# EAGLE design SAMD11 Arduino Small Form Factor (EAGLE 9.4.2)
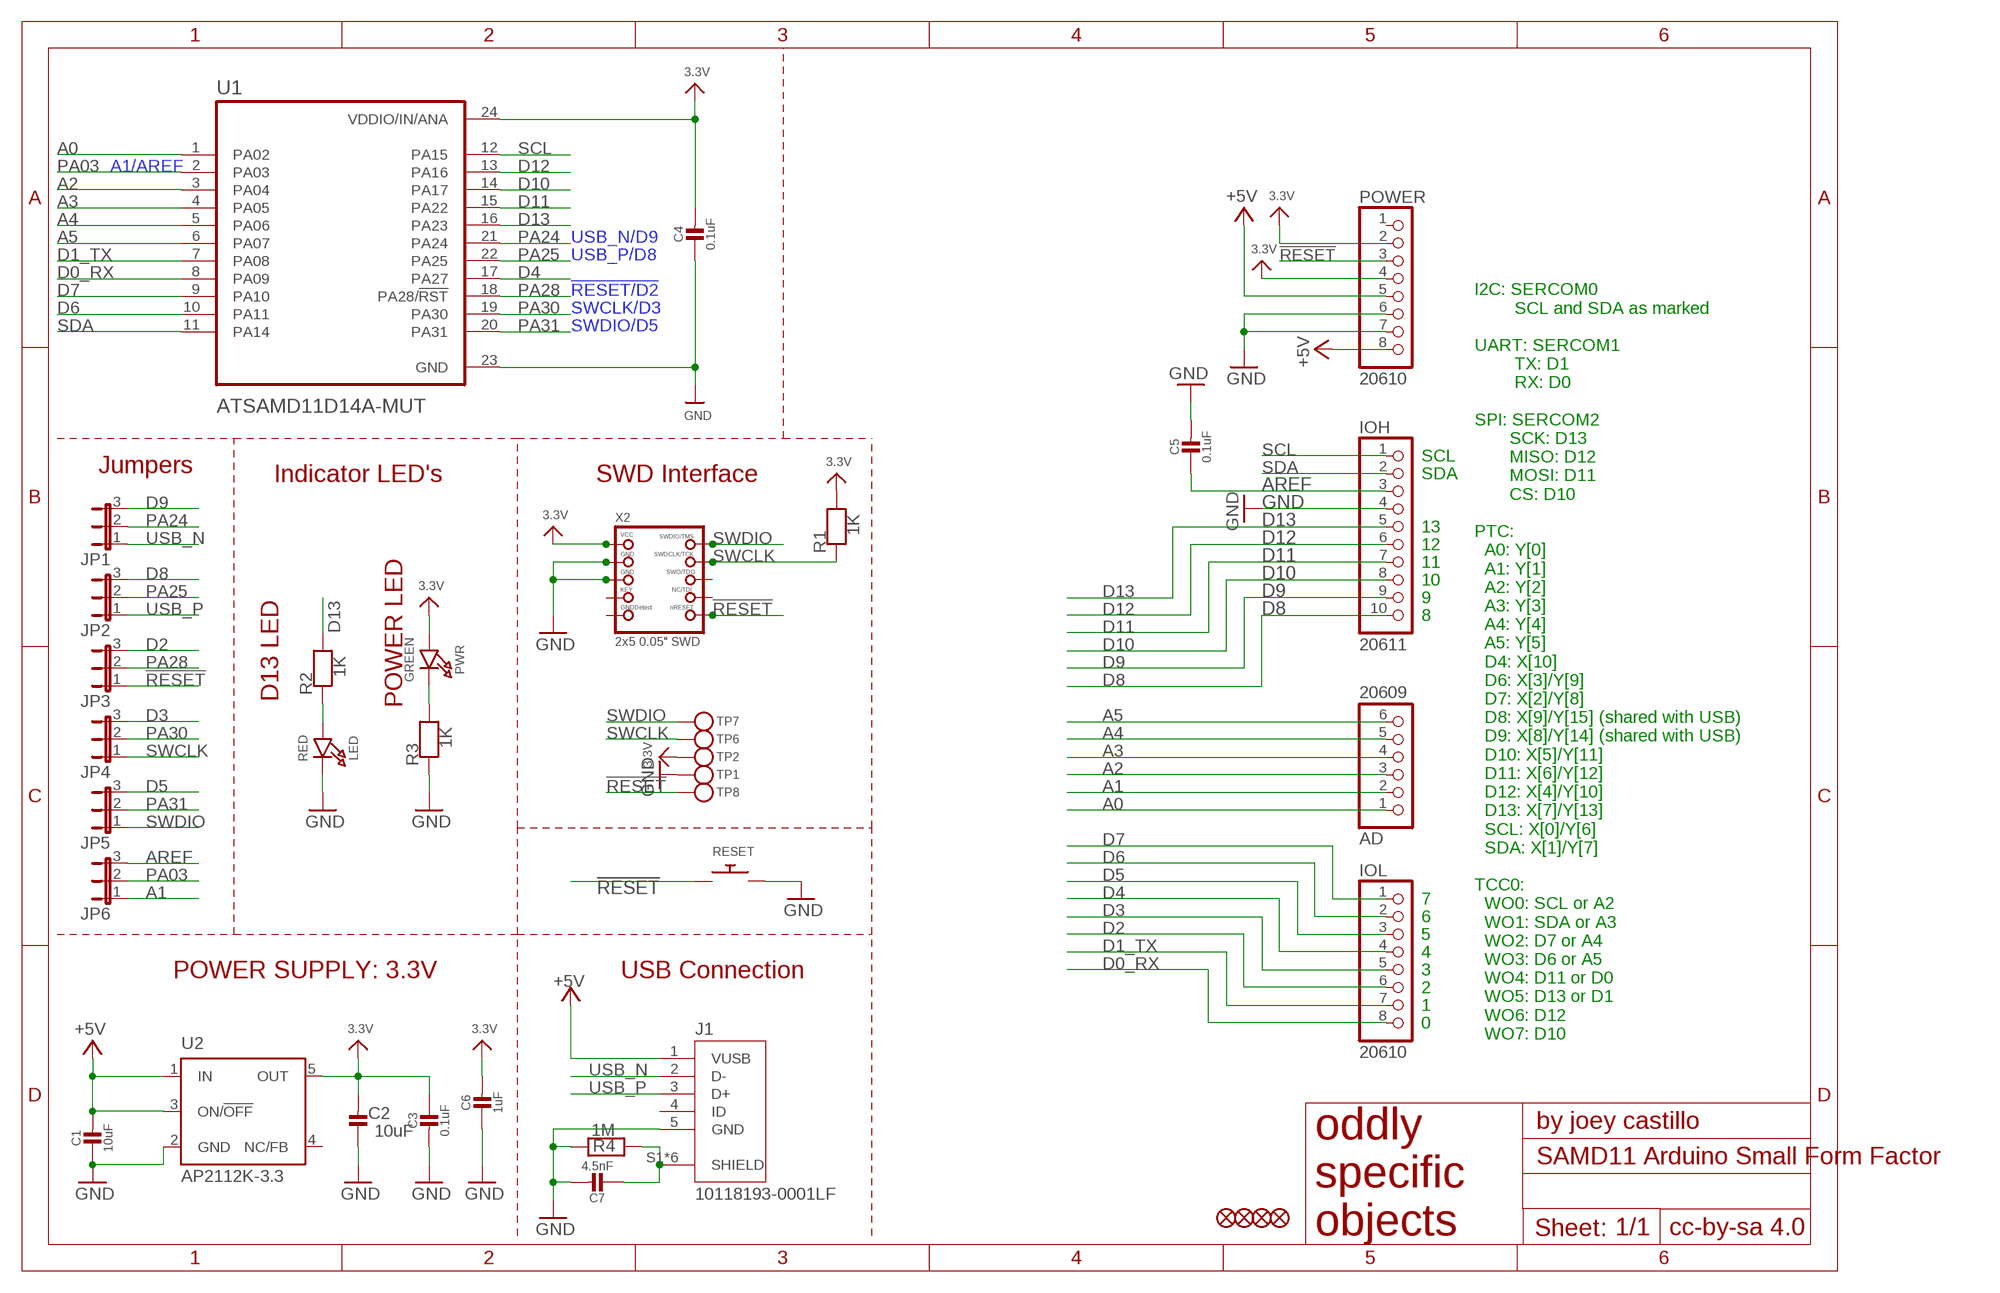
[diagram p0: schematic, sheet 1, part 1 of 2]
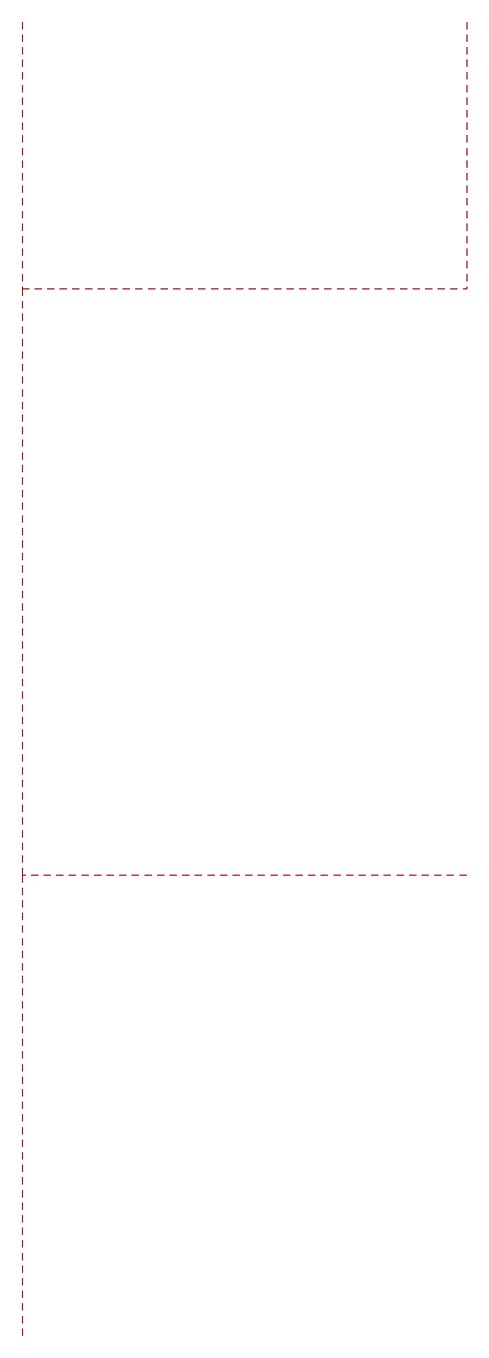
[diagram p1: schematic, sheet 1, part 2 of 2]

## Parts
AD  20609  HEADER-1X6OVALWAVE  [1X06_OVALWAVE]
C1  10uF  CAP_CERAMIC0805-NOOUTLINE  [0805-NO]
C2  10uF  CAP_CERAMIC0805-NOOUTLINE  [0805-NO]
C3  0.1uF  CAP_CERAMIC0805-NOOUTLINE  [0805-NO]
C4  0.1uF  CAP_CERAMIC0805-NOOUTLINE  [0805-NO]
C5  0.1uF  CAP_CERAMIC0805-NOOUTLINE  [0805-NO]
C6  1uF  CAP_CERAMIC0805-NOOUTLINE  [0805-NO]
C7  4.5nF  CAP_CERAMIC0805-NOOUTLINE  [0805-NO]
FD1  FIDUCIAL_1MM  [FIDUCIAL_1MM]
FD2  FIDUCIAL_1MM  [FIDUCIAL_1MM]
FD3  FIDUCIAL_1MM  [FIDUCIAL_1MM]
FD4  FIDUCIAL_1MM  [FIDUCIAL_1MM]
IOH  20611  HEADER-1X10OVALWAVE  [1X10_OVALWAVE]
IOL  20610  HEADER-1X8OVALWAVE  [1X08_OVALWAVE]
J1  10118193-0001LF  [FCI_10118193-0001LF]
JP1  JP2E  [JP2]
JP2  JP2E  [JP2]
JP3  JP2E  [JP2]
JP4  JP2E  [JP2]
JP5  JP2E  [JP2]
JP6  JP2E  [JP2]
LED  RED  LED0805_NOOUTLINE  [CHIPLED_0805_NOOUTLINE]
POWER  20610  HEADER-1X8OVALWAVE  [1X08_OVALWAVE]
PWR  GREEN  LED0805_NOOUTLINE  [CHIPLED_0805_NOOUTLINE]
R1  1K  RESISTOR0805_NOOUTLINE  [0805-NO]
R2  1K  RESISTOR0805_NOOUTLINE  [0805-NO]
R3  1K  RESISTOR0805_NOOUTLINE  [0805-NO]
R4  1M  RESISTOR0805_NOOUTLINE  [0805-NO]
RESET  SWITCH_PUSHBUTTONEVQ-PE  [TACT_PANA-EVQ]
TP1  TESTPOINTROUND2MMNO  [TESTPOINT_ROUND_2MM_NO]
TP2  TESTPOINTROUND2MMNO  [TESTPOINT_ROUND_2MM_NO]
TP6  TESTPOINTROUND2MMNO  [TESTPOINT_ROUND_2MM_NO]
TP7  TESTPOINTROUND2MMNO  [TESTPOINT_ROUND_2MM_NO]
TP8  TESTPOINTROUND2MMNO  [TESTPOINT_ROUND_2MM_NO]
U1  ATSAMD11D14A-MUT  [QFN50P400X400X90-25N]
U2  AP2112K-3.3  LP2985-XXDBVR33  [SOT23-DBV]
X2  2x5 0.05" SWD  JTAG-CORTEXBOXPOSTS  [2X05_1.27MM_BOX_POSTS]

## Nets
3.3V [power]: C2.2 C3.1 C4.2 C6.2 POWER.2 POWER.4 PWR.A R1.2 TP2.P$1 U1.24(VDDIO/IN/ANA) U2.5(OUT) X2.1(VCC)
!RESET: JP3.1 POWER.3 RESET.P$1 TP8.P$1 X2.10(NRESET)
+5V [power]: C1.2 J1.1(VUSB) POWER.5 POWER.8 U2.1(IN) U2.3(ON/!OFF)
A0: AD.1 U1.1(PA02)
A1: AD.2 JP6.1
A2: AD.3 U1.3(PA04)
A3: AD.4 U1.4(PA05)
A4: AD.5 U1.5(PA06)
A5: AD.6 U1.6(PA07)
AREF [aref]: C5.1 IOH.3 JP6.3
D0_RX: IOL.8 U1.8(PA09)
D1_TX: IOL.7 U1.7(PA08)
D2: IOL.6 JP3.3
D3: IOL.5 JP4.3
D4: IOL.4 U1.17(PA27)
D5: IOL.3 JP5.3
D6: IOL.2 U1.10(PA11)
D7: IOL.1 U1.9(PA10)
D8: IOH.10 JP2.3
D9: IOH.9 JP1.3
D10: IOH.8 U1.14(PA17)
D11: IOH.7 U1.15(PA22)
D12: IOH.6 U1.13(PA16)
D13: IOH.5 R2.2 U1.16(PA23)
GND [gnd]: C1.1 C2.1 C3.2 C4.1 C5.2 C6.1 C7.2 IOH.4 J1.5(GND) LED.C POWER.6 POWER.7 R3.1 R4.2 RESET.P$2 TP1.P$1 U1.23(GND) U2.2(GND) X2.3(GND) X2.5(GND)
N$1: LED.A R2.1
N$3: PWR.C R3.2
PA03: JP6.2 U1.2(PA03)
PA24 [USB]: JP1.2 U1.21(PA24)
PA25 [USB]: JP2.2 U1.22(PA25)
PA28: JP3.2 U1.18(PA28/!RST)
PA30: JP4.2 U1.19(PA30)
PA31: JP5.2 U1.20(PA31)
SCL: IOH.1 U1.12(PA15)
SDA: IOH.2 U1.11(PA14)
SHIELD [gnd]: C7.1 J1.S1(SHIELD) J1.S2(SHIELD) J1.S3(SHIELD) J1.S4(SHIELD) J1.S5(SHIELD) J1.S6(SHIELD) R4.1
SWCLK: JP4.1 R1.1 TP6.P$1 X2.4(SWDCLK)
SWDIO: JP5.1 TP7.P$1 X2.2(SWDIO)
USB_N [USB]: J1.2(D-) JP1.1
USB_P [USB]: J1.3(D+) JP2.1
Unconnected: J1.4(ID) POWER.1 U2.4(NC/FB) X2.6(SWO) X2.7(KEY) X2.8(TDI) X2.9(GNDDETECT)

## Notes on the sheet
- A1/AREF
- USB_N/D9
- USB_P/D8
- !RESET/D2
- SWCLK/D3
- SWDIO/D5
- SCL
- Jumpers
- Indicator LED's | SWD Interface | SDA
- 13
- 12
- 11
- 10
- 9
- 8
- POWER LED
- D13 LED
- 7
- 6
- 5
- 4
- POWER SUPPLY: 3.3V | USB Connection | 3
- 2
- 1
- 0
- I2C: SERCOM0
          SCL and SDA as marked
  
  UART: SERCOM1
          TX: D1
          RX: D0
  
  SPI: SERCOM2
         SCK: D13
         MISO: D12
         MOSI: D11
         CS: D10
  
  PTC:
    A0: Y[0]
    A1: Y[1]
    A2: Y[2]
    A3: Y[3]
    A4: Y[4]
    A5: Y[5]
    D4: X[10]
    D6: X[3]/Y[9]
    D7: X[2]/Y[8]
    D8: X[9]/Y[15] (shared with USB)
    D9: X[8]/Y[14] (shared with USB)
    D10: X[5]/Y[11]
    D11: X[6]/Y[12]
    D12: X[4]/Y[10]
    D13: X[7]/Y[13]
    SCL: X[0]/Y[6]
    SDA: X[1]/Y[7]
  
  TCC0:
    WO0: SCL or A2
    WO1: SDA or A3
    WO2: D7 or A4
    WO3: D6 or A5
    WO4: D11 or D0
    WO5: D13 or D1
    WO6: D12
    WO7: D10

## Library data of the parts
AD = microbuilder:HEADER-1X6: PIN HEADER
C1-C7 = microbuilder:CAP_CERAMIC: Ceramic Capacitors For new designs, use the packages preceded by an '_' character since they are more reliable: The following footprints should be used on most boards: _0402 - Standard footprint for regular board layouts _0603 - Standard footprint for regular board layouts _0805 - Standard footprint for regular board layouts _1206 - Standard footprint for regular board layouts For extremely tight-pitch boards where space is at a premium, the following 'micro-pitch' footprints can be used (smaller pads, no silkscreen outline, etc.): _0402MP - Micro-pitch footprint for very dense/compact boards _0603MP - Micro-pitch footprint for very dense/compact boards _0805MP - Micro-pitch footprint for very dense/compact boards _1206MP - Micro-pitch footprint for very dense/compact boards
FD1-FD4 = microbuilder:FIDUCIAL: Fiducial Alignment Points Various fiducial points for machine vision alignment.; BOM: EXCLUDE
IOH = microbuilder:HEADER-1X10: PIN HEADER
IOL POWER = microbuilder:HEADER-1X8: PIN HEADER
J1 = 10118193-0001LF:10118193-0001LF: Micro USB B Type Receptacle; DESCRIPTION: Single Port 5 Contact Shielded SMT MICRO USB B-Type Receptacle; DIGI-KEY_PART_NUMBER: 609-4616-1-ND; DIGI-KEY_PURCHASE_URL: https://www.digikey.com/product-detail/en/amphenol-icc-fci/10118193-0001LF/609-4616-1-ND/2785380?utm_source=snapeda&utm_medium=aggregator&utm_campaign=symbol; MF: Amphenol ICC; MP: 10118193-0001LF; PACKAGE: None
JP1-JP6 = jumper:JP2E: JUMPER
LED PWR = microbuilder:LED: LED 0603 - 0603 Surface Mount Package 2mA: Green LED - Low Power (3.9mcd, 2ma, 1.7Vf) - Digikey: 475-2709-2-ND Orange LED - Low Power (9.8mcd, 2ma, 1.8Vf) - Digikey: 475-1194-2-ND Red LED - Low Power (5mcd, 2ma, 1.8Vf) - Digikey: 475-1195-2-ND Yellow LED - Low Power (7mcd, 2ma, 1.8Vf) - Digikey: 475-1196-2-ND 5mA: Blue LED - Low Power (17mcd, 5ma, 2.9Vf) - Digikey: LNJ937W8CRACT-ND 0805 - 0805 Surface Mount Package 2mA: Red LED (8.8mcd, 2mA, 1.8Vf, Clear) - Low Power [Digikey: 475-2510-1-ND] Green LED (5mcd, 2mA, 1.8Vf, Clear) - Low Power [Digikey: 475-2730-1-ND] Yellow LED (11.3mcd, 2mA, 1.8Vf, Clear) - Low Power [Digikey: 475-2555-1-ND] 20mA: Red LED (104mcd, 20mA, Diffused) - LS R976 [Digikey: 475-1278-6-ND] Red LED (12mcd, 20mA, 2.0Vf, Clear) - APT2012EC [Digikey: 754-1128-1-ND] Green LED (15mcd, 20mA, 2.2Vf, Clear) - APT2012GC [Digikey: 754-1131-1-ND] Orange LED (160mcd, 20mA, 2.1Vf, Clear) - APT2012SECK [Digikey: 754-1130-1-ND] 1206 - 1206 Surface Mount Package Green LED (26mcd, 20mA, Diffused) - LG N971 [Digikey: 475-1407-6-ND] Red LED (15mcd, 20mA, Diffused) - LH N974 [Digikey: 475-1416-6-ND] Cree - Cree High-Power Surface Mount LEDs XPEBWT-L1-0000-00D50 - White 111lm 350mA 2.9Vf 6200K 110° XTEAWT-00-0000-00000LEE3 - White 114lm 350mA 2.85Vf 5000K 115° Everlight - Everlight 45-21 Series Surface Mount LEDs 45-21/QK2C-B2832AC2CB2/2T - Warm White 2000mcd 20mA 3.25Vf 3050K 120° 45-21/LK2C-B38452C4CB2/2T - Nuetral White 2000mcd 20mA 3.25Vf 4150K 120° 45-21/LK2C-B50634C6CB2/2T - Cold White 2200mcd 20mA 3.25Vf 5650K 120° PLCC2 Reverse Mount LS T77K-J1L2-1-0-2-R18-Z - Red 11.25mcd 2mA 1.8Vf 630nm 120° LO T77K-L1M2-24-Z - Orange 19.6mcd 2mA 1.8Vf 606nm 120° LY T77K-K2M1-26-Z - Yellow 15.7mcd 2mA 1.8Vf 587nm 120°
R1-R4 = microbuilder:RESISTOR: Resistors For new designs, use the packages preceded by an '_' character since they are more reliable: The following footprints should be used on most boards: _0402 - Standard footprint for regular board layouts _0603 - Standard footprint for regular board layouts _0805 - Standard footprint for regular board layouts _1206 - Standard footprint for regular board layouts For extremely tight-pitch boards where space is at a premium, the following 'micro-pitch' footprints can be used (smaller pads, no silkscreen outline, etc.): _0402MP - Micro-pitch footprint for very dense/compact boards _0603MP - Micro-pitch footprint for very dense/compact boards _0805MP - Micro-pitch footprint for very dense/compact boards _1206MP - Micro-pitch footprint for very dense/compact boards
RESET = adafruit:SWITCH_PUSHBUTTON: Buttons SOFTTOUCHSMD_SJ - Soft touch temporary push button (Super Junk Akihabara) Compatible with SKPMANE010 [Mouser: 688-SKPMAN] C&K_KSS = Digikey: KSS221GLFS
TP1 TP2 TP6-TP8 = microbuilder:TESTPOINT: Test Point Various test points for characterisation and PCB testing TESTPOINT_SMT - Compact Surface Mount Test Point [Digikey: 5016KTR-ND]
U1 = ATSAMD11D14A-MUT:ATSAMD11D14A-MUT: None; AVAILABILITY: Unavailable; DESCRIPTION: Cortex-M0+, 16KB FLASH, 4KB SRAM, USB - 24 QFN, INDUSTRIAL, GREEN, 1.6-3.6V, 48MHz/ QFN _ZA_; MF: Microchip; MP: ATSAMD11D14A-MUT; PACKAGE: QFN-24 Microchip; PRICE: None
U2 = SmartPrj:LP2985-XXDBVR: ULTRALOW-POWER 50-mA LOW-DROPOUT LINEAR REGULATORS 50-mA Low-Dropout Regulator Source: http://focus.ti.com/lit/ds/symlink/tps77001.pdf
X2 = microbuilder:JTAG-CORTEX: Serial Wire (SW-DP) Connector Standard 0.05" 10-pin connector is for use with the Cortex M and Cortex A SWD (serial wire debugger) interface (SW-DP) Connectors 2x05_1.27MM_SMT - Inexpensive surface-mount header with bare pins, compatible with standard 10-pin SWD cables (4UCON: 16846) 2x05_1.27MM_BOX_NOPOSTS - Polarised surface-mount box (4UCON with caps: 19735, without caps: 15117 2x05_1.27MM_BOX_POSTS - Polarised surface-mount box with mounting holes (4UCON: 20317) Pinout: http://infocenter.arm.com/help/topic/com.arm.doc.faqs/attached/13634/cortex_debug_connectors.pdf http://www.keil.com/peripherals/coresight/connectors.asp

## Net classes
0 default: width 0.152 mm, drill 0.254 mm
1 USB: width 0.152 mm, drill 0.254 mm
2 gnd: width 0.254 mm, drill 0.254 mm
3 power: width 0.305 mm, drill 0.305 mm
4 aref: width 0.152 mm, drill 0.254 mm

## Board
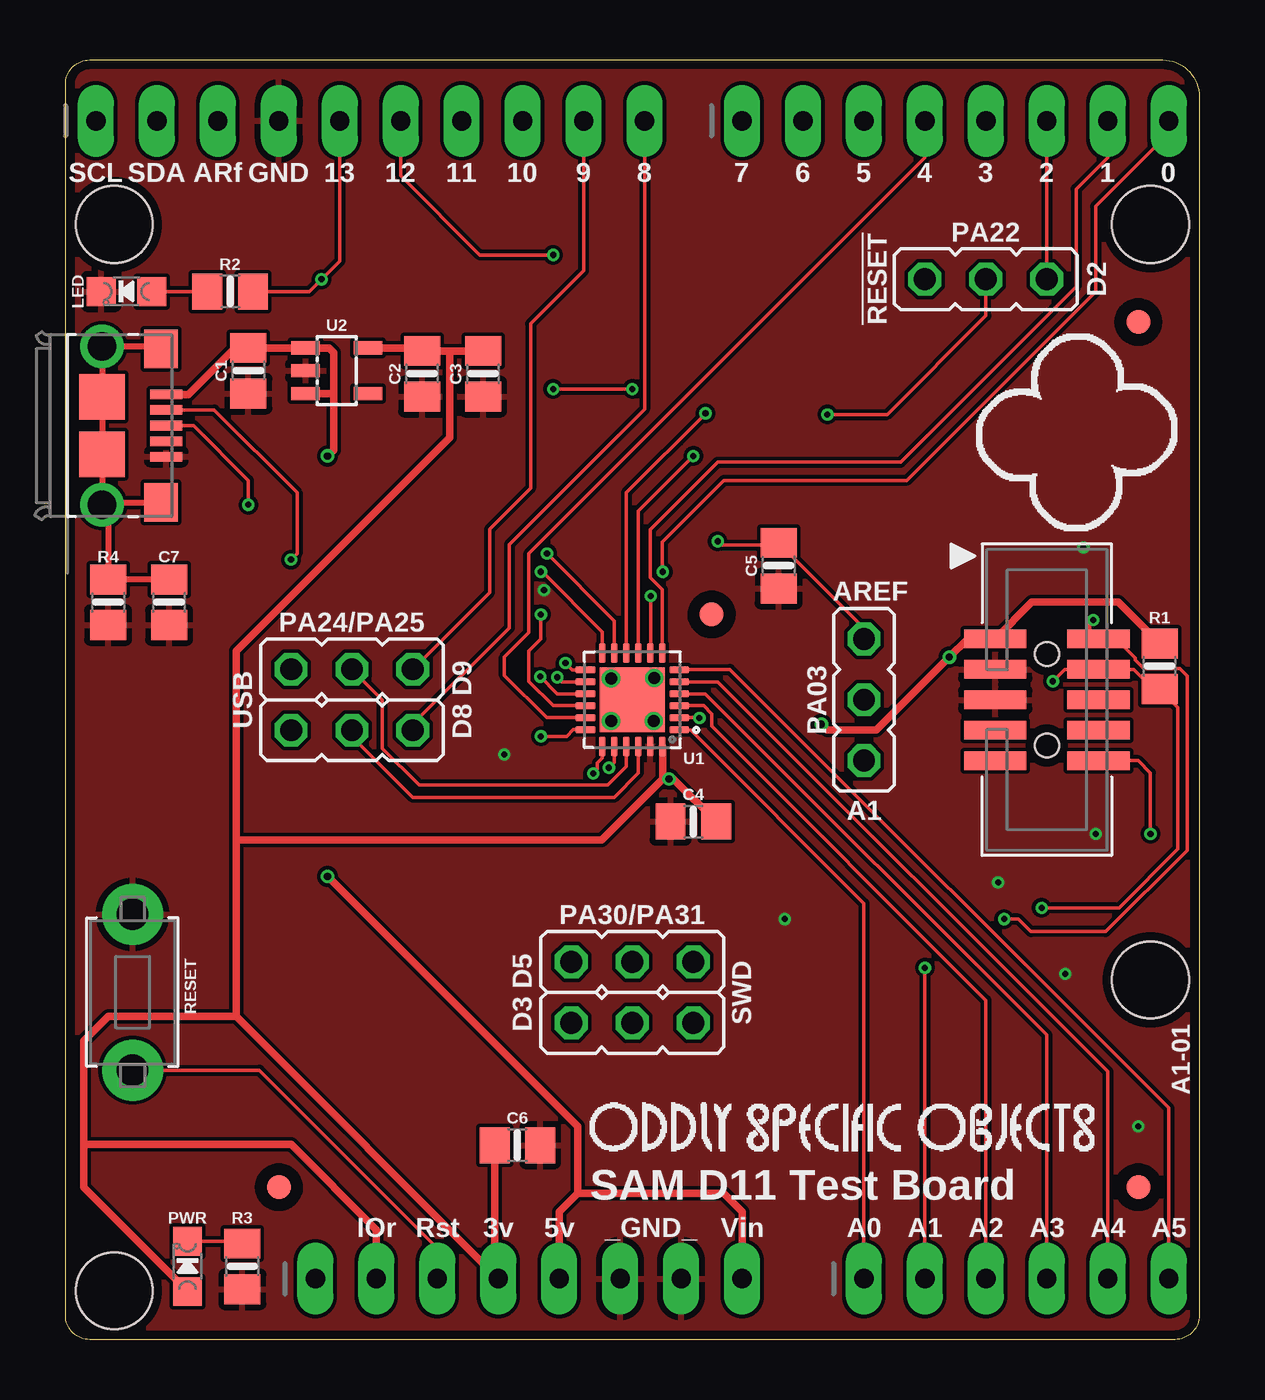
[diagram p2: board, top side]
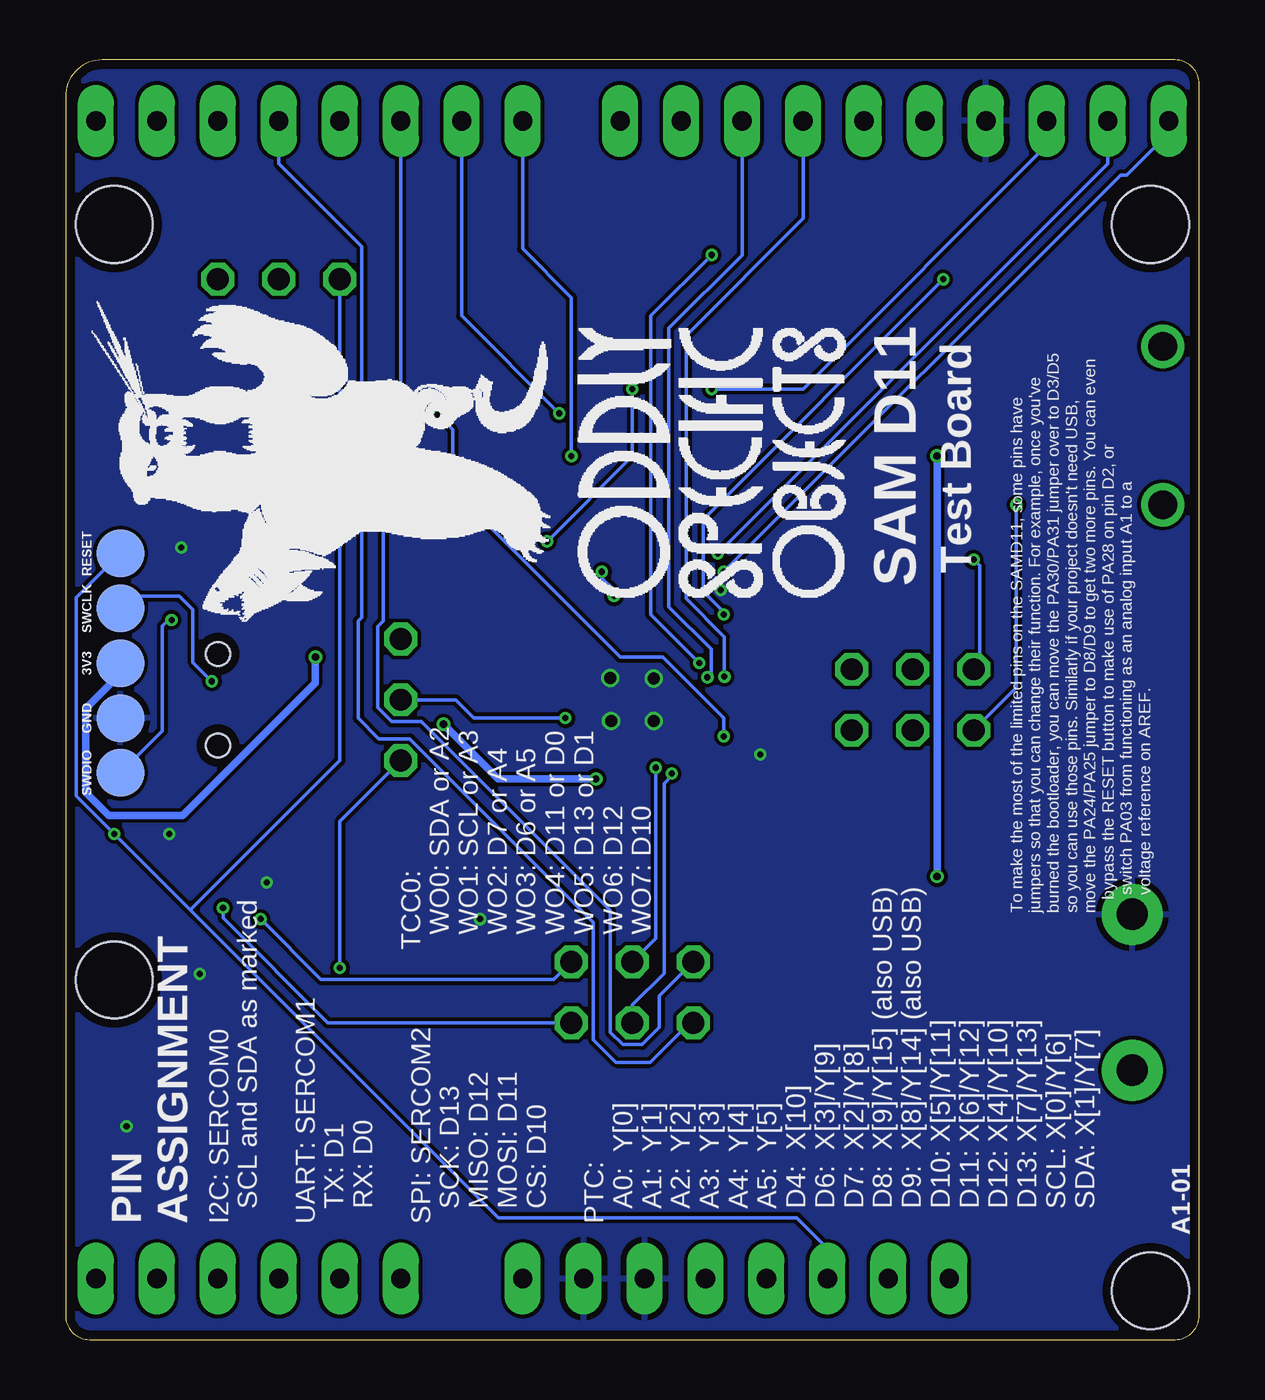
[diagram p3: board, bottom side, seen from below]

Size 47.24 x 53.34 mm. Coordinates in mm from the lower left corner, seen from the top.
Outline: 45.72,53.34 arc-90 47.24,51.82 47.24,1 arc-90 46.24,0 1,0 arc-90 0,1 0,52.34 arc-90 1,53.34 45.72,53.34
Copper layers (1*16): Top 0.035559375mm / dielectric 1.6mm / Bottom 0.035559375mm
Design rules "oshpark-2layer *": minimum track width 6mil, minimum drill 10mil, track to track 6mil, track to pad 6mil, pad to pad 6mil, via to via 6mil, smd to smd 6mil, copper to edge 15mil, drill to drill 6mil, minimum pad ring 5mil, minimum via ring 5mil, stop-mask expansion 2.5mil, vias tented up to drill 12mil, thermal gap 10mil
Holes 3.2 mm at 45.21,46.48 45.21,14.99 2.03,46.48 2.03,2.03

### Footprints (pad centres in the part's own frame; a part is rotated, then mirrored left to right if it is on the bottom)
1X06_OVALWAVE = drill 0.8 pad 1.5 long: 1 -6.35,0; 2 -3.81,0; 3 -1.27,0; 4 1.27,0; 5 3.81,0; 6 6.35,0
0805-NO = smd 1.24 x 1.5: 1 -0.95,0; 2 0.95,0
FIDUCIAL_1MM = smd 1 x 1: 1 0,0
1X10_OVALWAVE = drill 0.8 pad 1.5 long: 1 -11.43,0; 2 -8.89,0; 3 -6.35,0; 4 -3.81,0; 5 -1.27,0; 6 1.27,0; 7 3.81,0; 8 6.35,0; 9 8.89,0; 10 11.43,0
1X08_OVALWAVE = drill 0.8 pad 1.5 long: 1 -8.89,0; 2 -6.35,0; 3 -3.81,0; 4 -1.27,0; 5 1.27,0; 6 3.81,0; 7 6.35,0; 8 8.89,0
FCI_10118193-0001LF = smd 0.4 x 1.35: 1 -1.3,2.675; 2 -0.65,2.675; 3 0,2.675; 4 0.65,2.675; 5 1.3,2.675 | smd 1.6 x 1.4: S1 -3.2,2.45; S2 3.2,2.45 | smd 1.9 x 1.9: S3 1.2,0; S4 -1.2,0 | drill 1.2: S5 3.302,0; S6 -3.302,0
JP2 = drill 0.914 octagon: 1 -2.54,0; 2 0,0; 3 2.54,0
CHIPLED_0805_NOOUTLINE = smd 1.2 x 1.2: A 0,-1.05; C 0,1.05
TACT_PANA-EVQ = drill 1.3 pad 2.54: P$1 -3.25,0; P$2 3.25,0
TESTPOINT_ROUND_2MM_NO = smd 2 x 2: P$1 0,0
QFN50P400X400X90-25N = smd 0.81 x 0.27: 1 -1.955,1.25; 2 -1.955,0.75; 3 -1.955,0.25; 4 -1.955,-0.25; 5 -1.955,-0.75; 6 -1.955,-1.25; 13 1.955,-1.25; 14 1.955,-0.75; 15 1.955,-0.25; 16 1.955,0.25; 17 1.955,0.75; 18 1.955,1.25 | smd 0.27 x 0.81: 7 -1.25,-1.955; 8 -0.75,-1.955; 9 -0.25,-1.955; 10 0.25,-1.955; 11 0.75,-1.955; 12 1.25,-1.955; 19 1.25,1.955; 20 0.75,1.955; 21 0.25,1.955; 22 -0.25,1.955; 23 -0.75,1.955; 24 -1.25,1.955 | smd 2.7 x 2.7: 25 0,0
SOT23-DBV = smd 0.55 x 1.2: 1 -0.95,-1.3; 2 0,-1.3; 3 0.95,-1.3; 4 0.95,1.3; 5 -0.95,1.3
2X05_1.27MM_BOX_POSTS = smd 0.76 x 2.6: 1 -2.54,-2.15; 2 -2.54,2.15; 3 -1.27,-2.15; 4 -1.27,2.15; 5 0,-2.15; 6 0,2.15; 7 1.27,-2.15; 8 1.27,2.15; 9 2.54,-2.15; 10 2.54,2.15 | hole 1: -1.905,0; 1.905,0

### Placement (x,y rotation side)
AD  39.62,2.54 0 top
C1  7.62,40.39 90 top
C2  14.86,40.26 90 top
C3  17.4,40.26 270 top
C4  26.16,21.59 0 top
C5  29.72,32.26 270 top
C6  18.83,8.1 180 top
C7  4.32,30.73 270 top
FD1  26.92,30.23 0 top
FD2  44.7,6.35 0 top
FD3  44.7,42.42 0 top
FD4  8.89,6.35 0 top
IOH  12.7,50.8 0 top
IOL  37.08,50.8 0 top
J1  1.52,38.1 270 top
JP1  11.94,27.94 0 top
JP2  11.94,25.4 0 top
JP3  38.35,44.2 0 top
JP4  23.62,13.21 180 top
JP5  23.62,15.75 180 top
JP6  33.27,26.67 90 top
LED  2.54,43.69 90 top
POWER  19.3,2.54 0 top
PWR  5.08,3.05 0 top
R1  45.59,28.07 90 top
R2  6.86,43.69 0 top
R3  7.37,3.05 90 top
R4  1.78,30.73 270 top
RESET  2.79,14.48 90 top
TP1  44.96,25.91 90 bottom
TP2  44.96,28.19 90 bottom
TP6  44.96,30.48 90 bottom
TP7  44.96,23.62 90 bottom
TP8  44.96,32.77 90 bottom
U1  23.62,26.67 180 top
U2  11.3,40.39 270 top
U$3  [OSO_WORDMARK_THREELINE_450MIL_500DPI]  20.32,36.58 90 bottom
U$6  [OSO_LOGO_ROTATED_333MIL_500DPI]  42.16,37.85 0 top
U$10  [OSO_WORDMARK_ONELINE_725MIL_500DPI]  32.39,8.89 0 top
U$12  [OSO_BEAR_525X750MIL_500DPI]  36.65,36.63 90 bottom
X2  40.89,26.67 270 top

### Tracks (layer width: path | path; a pad name or v marks a point on that pad's centre or on a via)
3.3V  (via drill 0.3)
  Top 0.305: U2.5 14.73,41.34 C2.2 16,41.21 | 16,41.21 C3.1 | 16,41.21 16,37.59 7.11,28.7 7.11,20.83 | 7.11,20.83 7.11,13.46 | 7.11,13.46 POWER.4 17.88,2.69 C6.2 | 7.11,20.83 22.35,20.83 24.89,23.37 | 24.89,23.37 24.89,24.7 U1.24 | 24.89,23.37 v25.15,23.37 25.33,23.37 C4.2 | v31.5,25.65 31.75,25.4 33.78,25.4 v36.83,28.45 37.59,29.21 X2.1 40.27,30.73 43.88,30.73 R1.2 | 7.11,13.46 1.78,13.46 0.76,12.45 0.76,8.13 | PWR.A 5.08,2.02 0.76,6.34 0.76,8.13 | POWER.2 12.95,4.57 9.4,8.13 0.76,8.13
  Bottom 0.305: v25.15,23.37 29.21,23.37 v31.5,25.65 | TP2.P$1 44.96,27.75 46.41,26.3 46.41,22.82 45.44,21.84 42.35,21.84 36.83,27.37 v36.83,28.45
!RESET  (via drill 0.25)
  Top 0.152: POWER.3 15.49,3.81 8.08,11.23 RESET.P$1 | v45.21,21.08 45.21,23.62 44.7,24.13 X2.10
  Bottom 0.152: POWER.3 15.49,3.81 16.76,5.08 29.21,5.08 42.04,17.91 | 42.04,17.91 v45.21,21.08 46.79,22.66 46.79,30.94 TP8.P$1 | JP3.1 35.81,24.13 42.04,17.91
+5V  (via drill 0.3)
  Top 0.305: J1.1 5.11,39.4 7.05,41.34 C1.2 U2.1 10.99,41.34 11.18,41.15 11.18,39.37 | POWER.5 20.57,5.33 21.34,6.1 | 21.34,6.1 21.34,8.89 v10.92,19.3 | 11.18,39.37 11.18,37.08 v10.92,36.83 | U2.3 11.11,39.44 11.18,39.37 | 21.34,6.1 27.43,6.1 28.19,5.33 POWER.8
  Bottom 0.305: v10.92,19.3 v10.92,36.83
A0
  Top 0.152: U1.1 25.6,25.4 26.06,25.4 33.27,18.19 AD.1
A1  (via drill 0.25)
  Top 0.152: v35.81,15.49 AD.2
  Bottom 0.152: JP6.1 35.81,21.59 v35.81,15.49
A2
  Top 0.152: AD.3 38.35,14.15 26.92,25.58 26.92,26.08 26.59,26.42 U1.3
A3
  Top 0.152: U1.4 26.66,26.92 40.89,12.69 AD.4
A4
  Top 0.152: AD.5 43.43,11.18 27.19,27.42 U1.5
A5
  Top 0.152: AD.6 45.97,9.65 27.69,27.94 25.6,27.94 U1.6
AREF  (via drill 0.25)
  Top 0.152: C5.1 29.81,33.11 | 29.81,33.11 33.27,29.65 JP6.3 | v20.32,39.62 v23.62,39.62 | v27.18,33.27 27.34,33.11 29.81,33.11
  Bottom 0.152: IOH.3 6.35,49.78 16.51,39.62 v20.32,39.62 | v23.62,39.62 23.62,36.83 v27.18,33.27
D0_RX  (via drill 0.25)
  Top 0.152: IOL.8 45.97,50.29 42.93,47.24 42.93,43.69 35.05,35.81 27.43,35.81 24.87,33.25 24.87,32.02 v24.89,32 | v24.38,30.99 24.38,28.64 U1.8
  Bottom 0.152: v24.89,32 24.89,31.75 24.38,31.24 v24.38,30.99
D1_TX
  Top 0.152: IOL.7 43.43,49.28 42.11,47.95 42.11,43.89 34.8,36.58 27.18,36.58 24.37,33.77 24.37,31.76 24.87,31.26 U1.7
D2
  Top 0.152: IOL.6 JP3.3
D3
  Bottom 0.152: JP4.3 21.23,13.21 22.89,11.56 24.31,11.56 25.25,12.5 25.25,17.4 32.89,25.04 34.19,25.04 35.05,25.91 35.05,29.95 34.9,30.1 34.9,45.57 38.35,49.02 IOL.5
D4
  Top 0.152: IOL.4 35.81,49.28 19.3,32.77 19.3,29.46 18.29,28.45 18.29,27.69 20.05,25.92 U1.17
D5
  Bottom 0.152: IOL.3 33.27,38.78 34.01,38.05 34.01,29.95 34.24,29.72 34.24,26.34 33.66,25.76 32.41,25.76 24.54,17.88 24.54,12.8 24.03,12.29 23.22,12.29 22.5,13.01 22.5,14.33 JP5.3
D6  (via drill 0.25)
  Top 0.152: U1.10 23.37,35.31 v26.67,38.61
  Bottom 0.152: IOL.2 30.73,42.67 v26.67,38.61
D7  (via drill 0.25)
  Top 0.152: U1.9 23.87,34.54 v26.16,36.83
  Bottom 0.152: v26.16,36.83 26.16,43.43 28.19,45.47 IOL.1
D8
  Top 0.152: IOH.10 24.13,38.78 18.49,33.15 18.49,29.67 14.48,25.65 JP2.3
D9
  Top 0.152: JP1.3 17.68,31.14 17.68,33.78 19.38,35.48 19.38,42.34 21.59,44.55 IOH.9
D10  (via drill 0.25)
  Top 0.152: U1.14 20.68,27.42 v20.49,27.61
  Bottom 0.152: v20.49,27.61 20.35,27.76 20.35,28.78 22.1,30.53 22.1,42.16 19.05,45.21 IOH.8
D11  (via drill 0.25)
  Top 0.152: U1.15 20.5,26.92 v19.79,27.63
  Bottom 0.152: v19.79,27.63 19.79,29.29 21.39,30.89 21.39,41.86 16.51,46.74 IOH.7
D12  (via drill 0.25)
  Top 0.152: U1.13 21.11,27.92 v20.83,28.2 | v20.32,45.21 17.27,45.21 13.97,48.51 IOH.6
  Bottom 0.152: v20.83,28.2 22.86,30.23 22.86,42.67 v20.32,45.21
D13  (via drill 0.25)
  Top 0.152: v19.81,30.23 19.81,29.21 19.3,28.7 19.3,27.43 20.32,26.42 U1.16 | R2.2 10.16,43.69 v10.67,44.2 11.43,44.96 IOH.5
  Bottom 0.152: v19.81,30.23 19.81,30.33 20.68,31.19 20.68,34.19 v10.67,44.2
GND  (via drill 0.25, 0.5)
  other vias: 38.86,19.05 41.66,15.24 42.42,33.02 18.29,24.38 42.93,21.08 29.97,17.53 19.94,31.24 44.7,8.89 22.73,25.78 24.51,25.78 24.54,27.58 22.73,27.56
  pour Bottom (rank 5): -18.8,53.34 51.05,53.34 51.05,0 -18.8,0
  pour Top (rank 5): -19.3,53.34 52.58,53.34 52.58,0 -19.3,0
N$1
  Top 0.152: R2.1 LED.A
N$3
  Top 0.152: PWR.C 7.27,4.1 R3.2
PA03  (via drill 0.25)
  Top 0.152: U1.2 v26.4,25.92 v26.42,25.91
  Bottom 0.152: v26.42,25.91 30.23,25.91 30.99,26.67 JP6.2
PA24
  Top 0.152: U1.21 23.37,23.88 22.61,23.11 14.73,23.11 13.21,24.64 13.21,26.67 JP1.2
PA25
  Top 0.152: U1.22 23.88,23.62 22.86,22.61 14.48,22.61 11.94,25.15 JP2.2
PA28  (via drill 0.25)
  Top 0.152: U1.18 21.16,25.42 20.89,25.15 v19.81,25.15 | JP3.2 38.35,42.67 34.24,38.56 v31.75,38.56
  Bottom 0.152: v31.75,38.56 31.11,37.92 31.11,35.43 24.13,28.45 22.35,28.45 19.81,25.91 v19.81,25.15
PA30  (via drill 0.25)
  Top 0.152: U1.19 22.37,24.25 22.16,24.04 22.16,23.77 v21.99,23.6
  Bottom 0.152: v21.99,23.6 21.99,23.5 22.3,23.19 22.3,15.27 23.62,13.95 JP4.2
PA31  (via drill 0.25)
  Top 0.152: U1.20 22.87,24.06 v22.65,23.84
  Bottom 0.152: v22.65,23.84 22.65,16.72 JP5.2
SCL  (via drill 0.25)
  Top 0.152: U1.12 22.37,29.5 19.86,32 v19.81,32
  Bottom 0.152: IOH.1 1.27,50.29 3.02,48.54 3.28,48.54 v19.81,32
SDA  (via drill 0.25)
  Top 0.152: U1.11 22.87,29.96 v20.07,32.77
  Bottom 0.152: v20.07,32.77 3.81,49.02 IOH.2
SHIELD
  Top 0.254: J1.S1 3.87,41.4 J1.S6 J1.S4 J1.S3 J1.S5 | J1.S5 1.63,34.9 J1.S2 | J1.S5 1.78,34.54 R4.1 C7.1
SWCLK  (via drill 0.25)
  Top 0.152: v40.68,17.99 43.9,17.99 46.36,20.45 46.36,26.36 R1.1 45.34,27.12 44.52,27.94 X2.4 41.65,27.94 v41.15,27.44
  Bottom 0.152: JP4.1 36.32,13.21 40.68,17.57 v40.68,17.99 | v41.15,27.44 41.94,28.23 41.94,30.43 42.5,30.99 44.45,30.99 TP6.P$1
SWDIO  (via drill 0.25)
  Top 0.152: v39.12,17.53 39.7,17.53 40.23,17 43.34,17 46.74,20.4 46.74,27.67 46.44,27.97 44.93,27.97 44.57,28.32 44.57,28.41 43.78,29.21 X2.2 42.67,29.21 42.67,29.84 v42.82,30
  Bottom 0.152: JP5.1 26.9,15.01 36.6,15.01 v39.12,17.53 | TP7.P$1 43.2,25.38 43.2,29.74 42.95,30 v42.82,30
USB_N  (via drill 0.25)
  Top 0.152: J1.2 6.21,38.75 9.65,35.31 9.65,32.77 v9.4,32.51
  Bottom 0.152: v9.4,32.51 9.14,32.26 9.14,28.19 JP1.1
USB_P  (via drill 0.25)
  Top 0.152: J1.3 5.33,38.1 7.62,35.81 v7.62,34.8
  Bottom 0.152: v7.62,34.8 7.62,27.18 JP2.1

### Text on the board
tPlace: SCL | SDA | ARf | GND | 13 | 12 | 11 | 10 | 9 | 8 | 7 | 6 | 5 | 4 | 3 | 2 | 1 | 0 | PA22 | !RESET | D2 | AREF | PA24/PA25 | USB | D8 D9 | PA03 | A1 | PA30/PA31 | D3 D5 | SWD | A1-01 | SAM D11 Test Board | IOr | Rst | 3v | 5v | _GND_ | Vin | A0 | A1 | A2 | A3 | A4 | A5
bPlace: Test Board | SAM D11 | RESET | SWCLK | 3V3 | GND | SWDIO | To make the most of the limited pins on the SAMD11, some pins have / jumpers so that you can change their function. For example, once you've / burned the bootloader, you can move the PA30/PA31 jumper over to D3/D5 / so you can use those pins. Similarly if your project doesn't need USB, / move the PA24/PA25 jumper to D8/D9 to get two more pins. You can even / bypass the RESET button to make use of PA28 on pin D2, or / switch PA03 from functioning as an analog input A1 to a / voltage reference on AREF. | TCC0: / WO0: SDA or A2 / WO1: SCL or A3 / WO2: D7 or A4 / WO3: D6 or A5 / WO4: D11 or D0 / WO5: D13 or D1 / WO6: D12 / WO7: D10 | A1-01 | I2C: SERCOM0 / SCL and SDA as marked / / UART: SERCOM1 / TX: D1 / RX: D0 / / SPI: SERCOM2 / SCK: D13 / MISO: D12 / MOSI: D11 / CS: D10 / / PTC: / A0: Y[0] / A1: Y[1] / A2: Y[2] / A3: Y[3] / A4: Y[4] / A5: Y[5] / D4: X[10] / D6: X[3]/Y[9] / D7: X[2]/Y[8] / D8: X[9]/Y[15] (also USB) / D9: X[8]/Y[14] (also USB) / D10: X[5]/Y[11] / D11: X[6]/Y[12] / D12: X[4]/Y[10] / D13: X[7]/Y[13] / SCL: X[0]/Y[6] / SDA: X[1]/Y[7] | PIN / ASSIGNMENT
214bmp: D:/SmartProjects/Snc/a4_bn_logo2.bmp